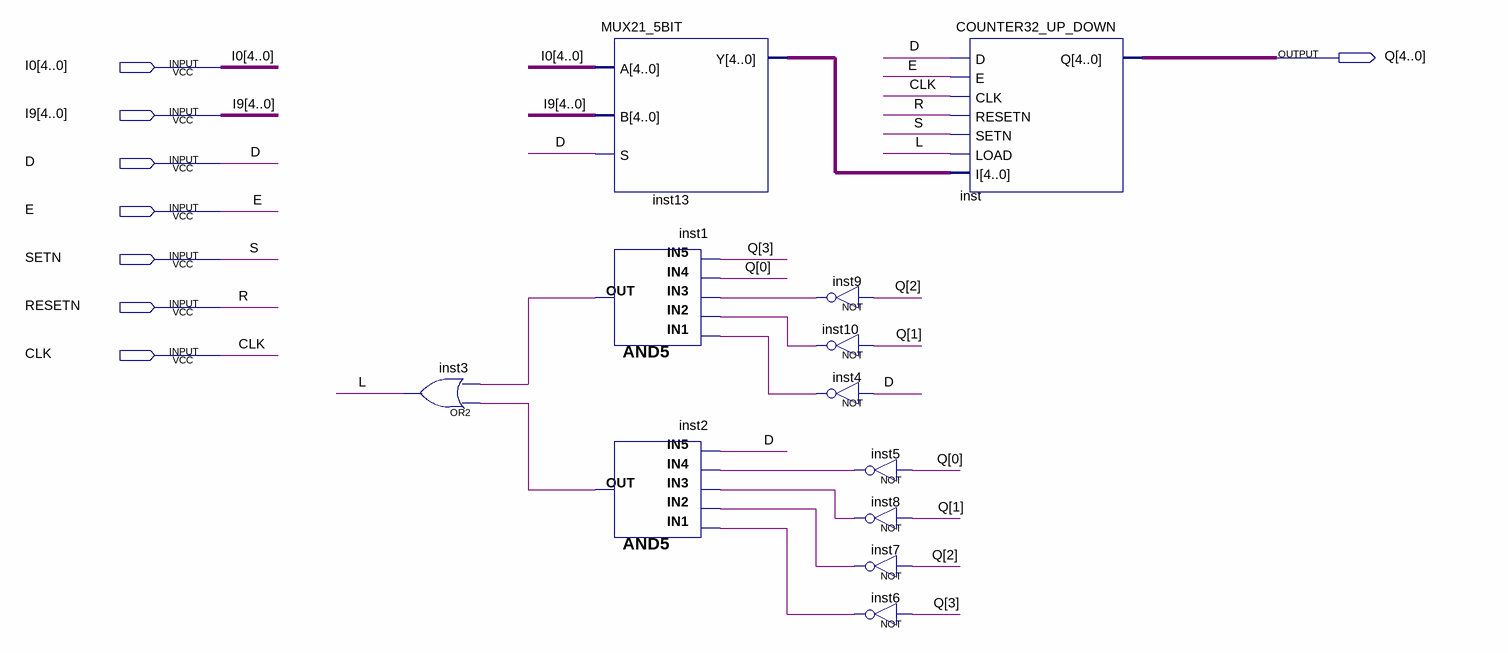
[diagram p0: schematic sheet]
// Quartus schematic BCD_COUNTER.bdf as structural Verilog: 12 symbols, 8 pins
module BCD_COUNTER (
  input  [4:0] I0,
  input  [4:0] I9,
  input  D,
  input  E,
  input  SETN,
  input  RESETN,
  input  CLK,
  output [4:0] Q
);

  wire inst1_out, inst2_out, inst4_out, inst5_out, inst6_out, inst7_out, inst8_out, inst9_out, inst10_out, L;
  wire [4:0] inst13_y;

  or inst3 (L, inst2_out, inst1_out);
  MUX21_5BIT inst13 (.A(I0), .B(I9), .S(D), .Y(inst13_y));
  and inst1 (inst1_out, inst4_out, inst10_out, inst9_out, Q[0], Q[3]);
  and inst2 (inst2_out, inst6_out, inst7_out, inst8_out, inst5_out, D);
  not inst9 (inst9_out, Q[2]);
  not inst10 (inst10_out, Q[1]);
  not inst4 (inst4_out, D);
  not inst5 (inst5_out, Q[0]);
  not inst8 (inst8_out, Q[1]);
  not inst7 (inst7_out, Q[2]);
  not inst6 (inst6_out, Q[3]);
  COUNTER32_UP_DOWN inst (.D(D), .E(E), .CLK(CLK), .RESETN(RESETN), .SETN(SETN), .LOAD(L), .I(inst13_y), .Q(Q));

  // Other names for the same wires on the sheet: R = RESETN; S = SETN
endmodule
